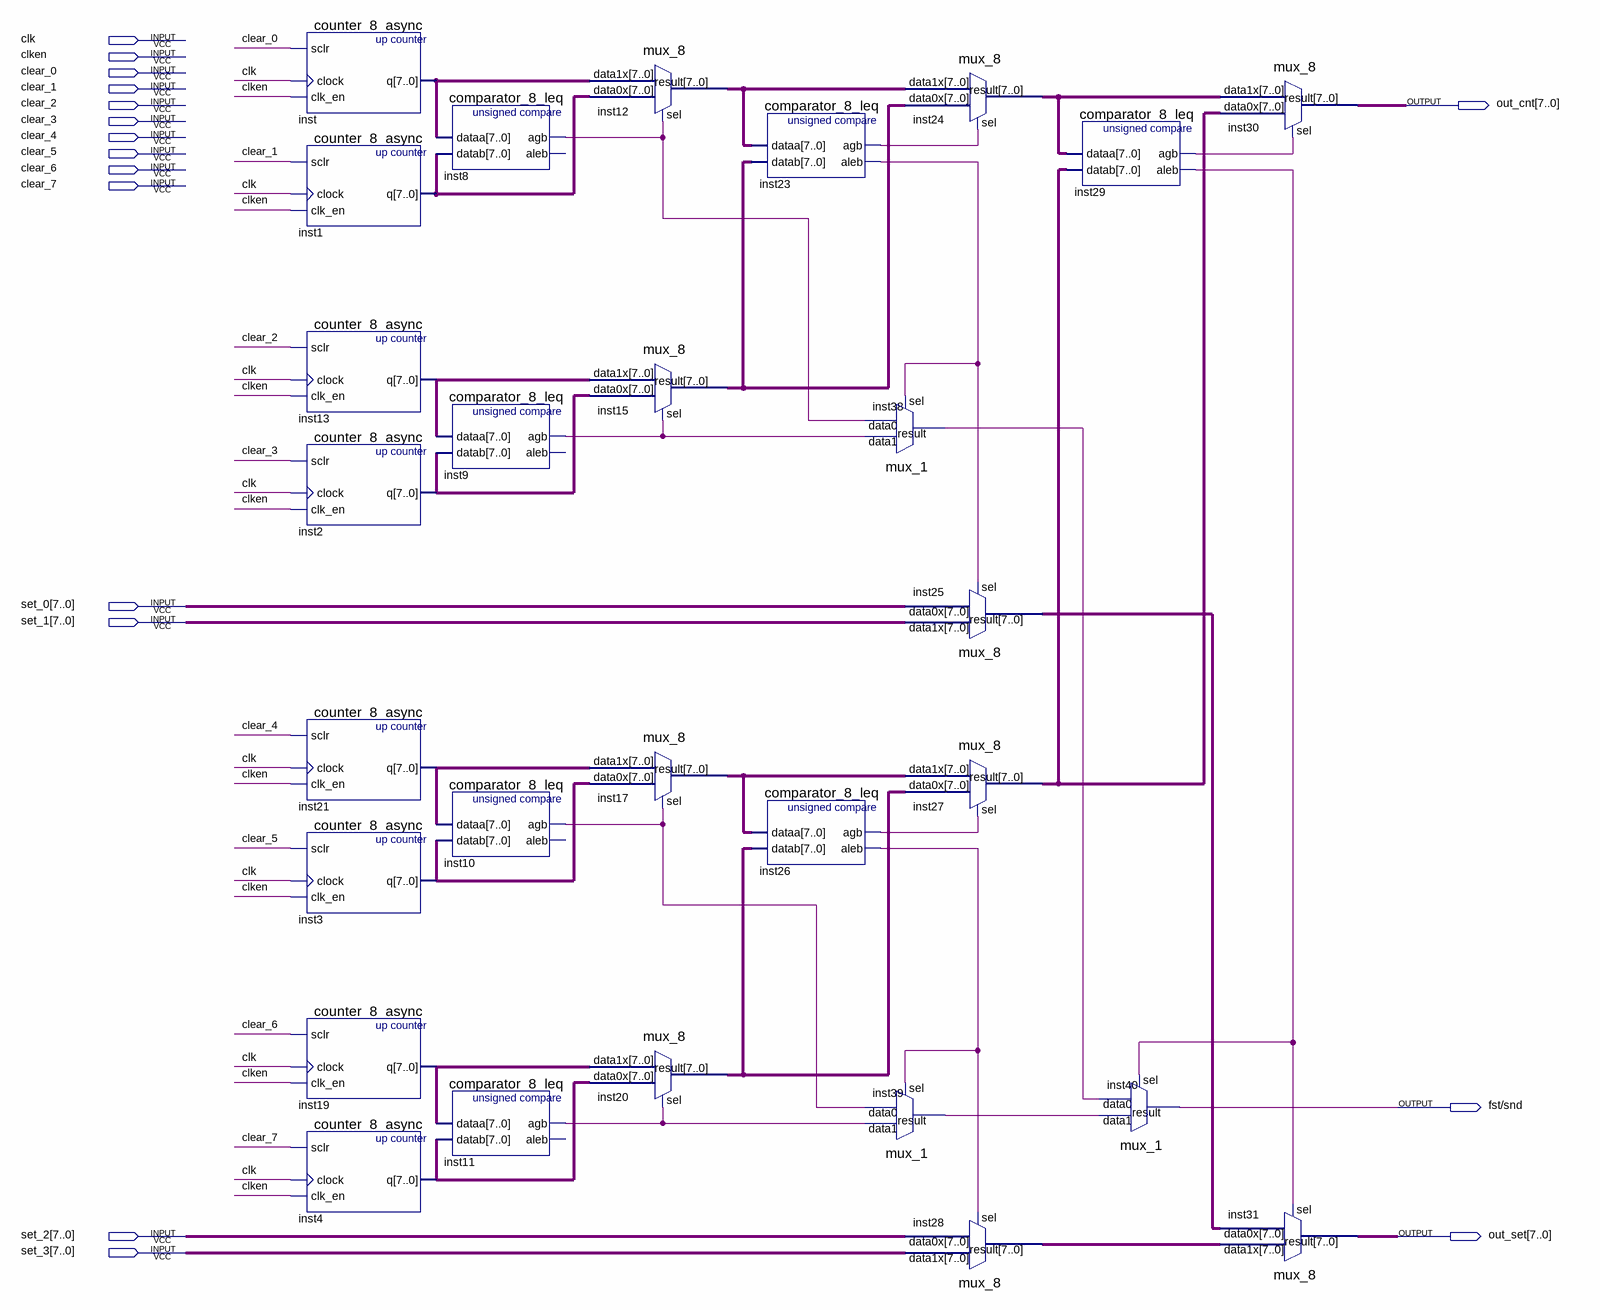
[diagram p0: schematic sheet]
// Quartus schematic cache_counters.bdf as structural Verilog: 28 symbols, 17 pins
module cache_counters (
  input  clk,
  input  clken,
  input  clear_0,
  input  clear_1,
  input  clear_2,
  input  clear_3,
  input  clear_4,
  input  clear_5,
  input  clear_6,
  input  clear_7,
  input  [7:0] set_0,
  input  [7:0] set_1,
  input  [7:0] set_2,
  input  [7:0] set_3,
  output [7:0] out_cnt,
  output \fst/snd ,
  output [7:0] out_set
);

  wire inst8_agb, inst9_agb, inst10_agb, inst11_agb, inst23_agb, inst23_aleb, inst26_agb, inst26_aleb,
       inst29_agb, inst29_aleb, inst38_result, inst39_result;
  wire [7:0] inst1_q, inst2_q, inst3_q, inst4_q, inst12_result, inst13_q, inst15_result, inst17_result,
       inst19_q, inst20_result, inst21_q, inst24_result, inst25_result, inst27_result, inst28_result, inst_q;

  counter_8_async inst (.sclr(clear_0), .clock(clk), .clk_en(clken), .q(inst_q));
  counter_8_async inst1 (.sclr(clear_1), .clock(clk), .clk_en(clken), .q(inst1_q));
  counter_8_async inst13 (.sclr(clear_2), .clock(clk), .clk_en(clken), .q(inst13_q));
  counter_8_async inst2 (.sclr(clear_3), .clock(clk), .clk_en(clken), .q(inst2_q));
  counter_8_async inst21 (.sclr(clear_4), .clock(clk), .clk_en(clken), .q(inst21_q));
  counter_8_async inst3 (.sclr(clear_5), .clock(clk), .clk_en(clken), .q(inst3_q));
  counter_8_async inst19 (.sclr(clear_6), .clock(clk), .clk_en(clken), .q(inst19_q));
  counter_8_async inst4 (.sclr(clear_7), .clock(clk), .clk_en(clken), .q(inst4_q));
  comparator_8_leq inst8 (.dataa(inst_q), .datab(inst1_q), .agb(inst8_agb));  // open: aleb
  comparator_8_leq inst9 (.dataa(inst13_q), .datab(inst2_q), .agb(inst9_agb));  // open: aleb
  comparator_8_leq inst10 (.dataa(inst21_q), .datab(inst3_q), .agb(inst10_agb));  // open: aleb
  comparator_8_leq inst11 (.dataa(inst19_q), .datab(inst4_q), .agb(inst11_agb));  // open: aleb
  mux_8 inst12 (.data1x(inst_q), .data0x(inst1_q), .sel(inst8_agb), .result(inst12_result));
  mux_8 inst15 (.data1x(inst13_q), .data0x(inst2_q), .sel(inst9_agb), .result(inst15_result));
  mux_8 inst17 (.data1x(inst21_q), .data0x(inst3_q), .sel(inst10_agb), .result(inst17_result));
  mux_8 inst20 (.data1x(inst19_q), .data0x(inst4_q), .sel(inst11_agb), .result(inst20_result));
  comparator_8_leq inst23 (.dataa(inst12_result), .datab(inst15_result), .agb(inst23_agb), .aleb(inst23_aleb));
  comparator_8_leq inst26 (.dataa(inst17_result), .datab(inst20_result), .agb(inst26_agb), .aleb(inst26_aleb));
  mux_8 inst24 (.data1x(inst12_result), .data0x(inst15_result), .sel(inst23_agb), .result(inst24_result));
  mux_1 inst38 (.data1(inst9_agb), .data0(inst8_agb), .sel(inst23_aleb), .result(inst38_result));
  mux_8 inst25 (.data1x(set_1), .data0x(set_0), .sel(inst23_aleb), .result(inst25_result));
  mux_8 inst27 (.data1x(inst17_result), .data0x(inst20_result), .sel(inst26_agb), .result(inst27_result));
  mux_1 inst39 (.data1(inst11_agb), .data0(inst10_agb), .sel(inst26_aleb), .result(inst39_result));
  mux_8 inst28 (.data1x(set_3), .data0x(set_2), .sel(inst26_aleb), .result(inst28_result));
  comparator_8_leq inst29 (.dataa(inst24_result), .datab(inst27_result), .agb(inst29_agb), .aleb(inst29_aleb));
  mux_1 inst40 (.data1(inst39_result), .data0(inst38_result), .sel(inst29_aleb), .result(\fst/snd ));
  mux_8 inst30 (.data1x(inst24_result), .data0x(inst27_result), .sel(inst29_agb), .result(out_cnt));
  mux_8 inst31 (.data1x(inst28_result), .data0x(inst25_result), .sel(inst29_aleb), .result(out_set));
endmodule
